# EAGLE design motor_driver_digital (EAGLE 6.2)
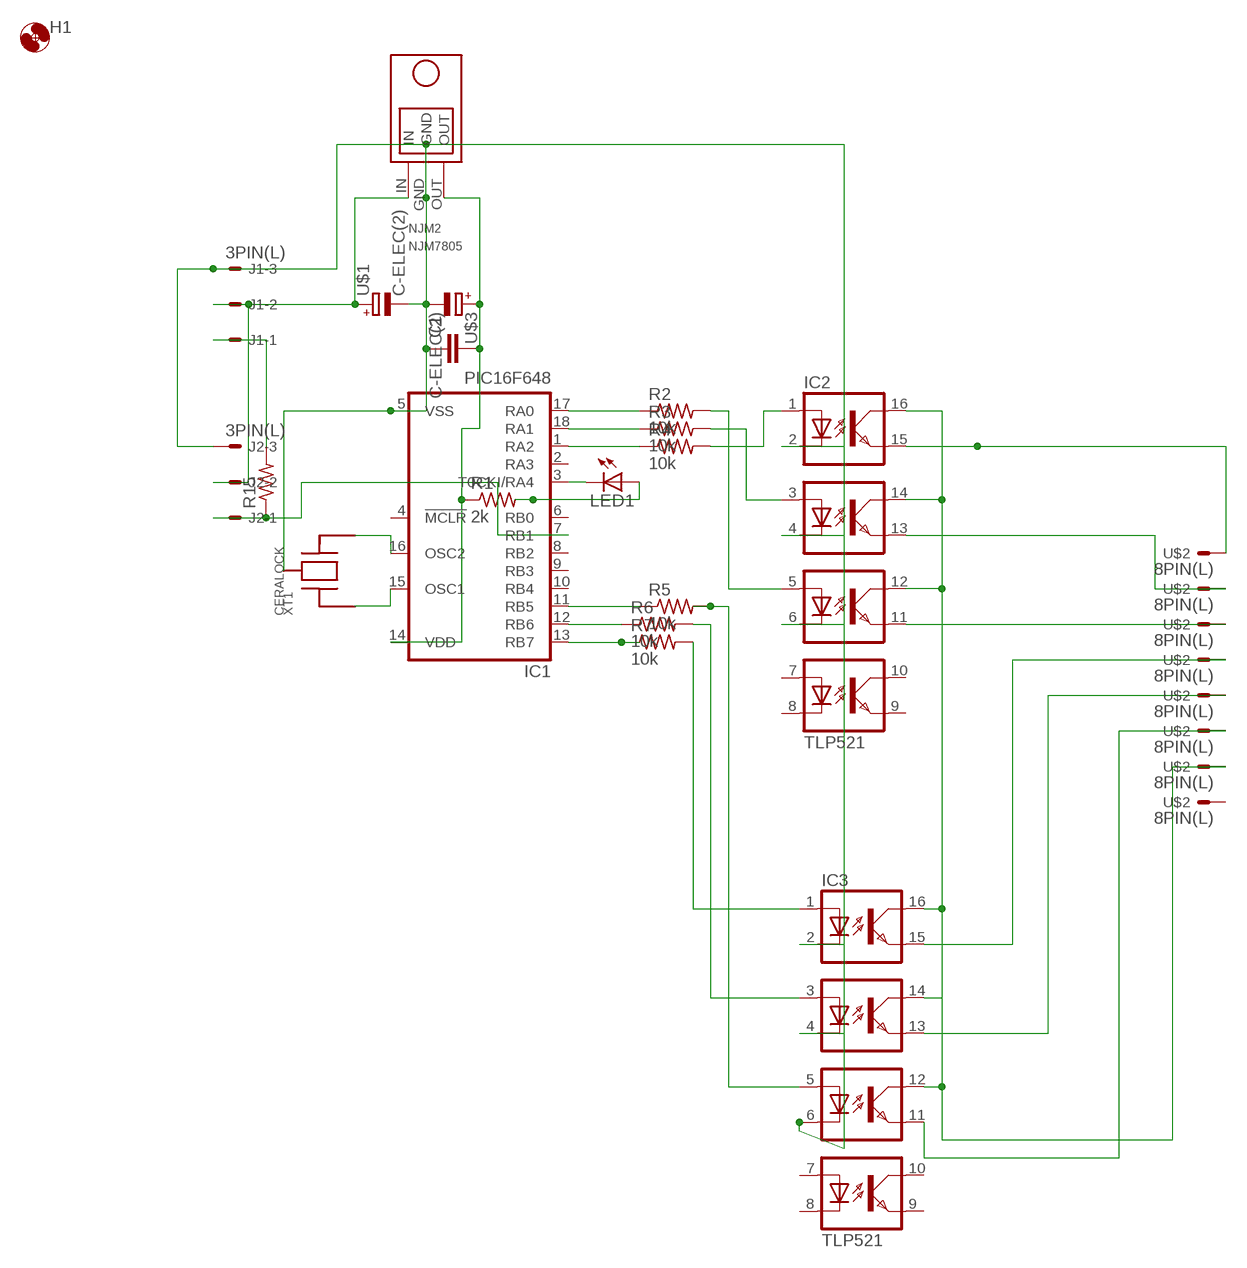
[diagram p0: schematic, sheet 1]

## Parts
C1  C-  [C-2.54]
H1  HOLE3.3M3BOLT  [HOLE3.3]
IC1  PIC16F648  [DIL18]
IC2  TLP521  [DIL16]
IC3  TLP521  [DIL16]
J1  3PIN(L)  [3PL]
J2  3PIN(L)  [3PL]
LED1  LED  [LED5MM]
NJM2  NJM7805  [NJM7805]
R1  2k  R-  [0207/10]
R2  10k  R-  [0207/10]
R3  10k  R-  [0207/10]
R4  10k  R-  [0207/10]
R5  10k  R-  [0207/10]
R6  10k  R-  [0207/10]
R7  10k  R-  [0207/10]
R15  R-  [0207/10]
U$1  C-ELEC(2)  [C-6MM(2)]
U$2  8PIN(L)  [8PL]
U$3  C-ELEC(2)  [C-6MM(2)]
XT1  CERALOCK  [CERALOCK]

## Nets
5V: C1.P$2 IC1.14(VDD) NJM2.OUT R1.1 U$3.+
9V: J1.2 J2.2 NJM2.IN U$1.+
12V: IC2.12(COL2) IC2.14(COL1) IC2.16(COL0) IC3.12(COL2) IC3.14(COL1) IC3.16(COL0) U$2.P7
FET_G2: IC3.11(EMIT2) U$2.P6
GND1: C1.P$1 IC1.5(VSS) IC2.2(C0) IC2.4(C1) IC2.6(C2) IC3.2(C0) IC3.4(C1) IC3.6(C2) J1.3 J2.3 NJM2.GND U$1.- U$3.- XT1.P2
LED_A: LED1.A R1.2
LED_C: IC1.3(T0CKI/RA4) LED1.K(C)
N$1: IC1.16(OSC2) XT1.P3
N$2: J1.1 R15.2
N$3: IC2.11(EMIT2) U$2.P3
N$7: IC1.15(OSC1) XT1.P1
N$10: IC1.17(RA0) R2.1
N$11: IC1.18(RA1) R3.1
N$12: IC1.1(RA2) R4.1
N$13: IC1.13(RB7) R7.1
N$14: IC1.12(RB6) R6.1
N$15: IC1.11(RB5) R5.1
N$16: IC2.5(A2) R2.2
N$17: IC2.3(A1) R3.2
N$18: IC2.1(A0) R4.2
N$19: IC3.1(A0) R7.2
N$20: IC3.3(A1) R6.2
N$21: IC3.5(A2) R5.2
N$23: IC2.15(EMIT0) U$2.P1
N$24: IC2.13(EMIT1) U$2.P2
N$25: IC3.15(EMIT0) U$2.P4
N$26: IC3.13(EMIT1) U$2.P5
SIGNAL: IC1.7(RB1) J2.1 R15.1
Unconnected: IC1.2(RA3) IC1.4(!MCLR) IC1.6(RB0) IC1.8(RB2) IC1.9(RB3) IC1.10(RB4) IC2.7(A3) IC2.8(C3) IC2.9(EMIT3) IC2.10(COL3) IC3.7(A3) IC3.8(C3) IC3.9(EMIT3) IC3.10(COL3) U$2.P8

## Library data of the parts
C1 = My_rcl:C-
H1 = FP-21T for MITS:HOLE3.3
IC1 = FP-21T for MITS:PIC16F648
IC2 IC3 = FP-21T for MITS:TLP521
J1 J2 = my_connector:3PIN(L)
LED1 = my_led:LED: LED
NJM2 = My_NJM7805:NJM7805
R1-R7 R15 = My_rcl:R-: Resistor
U$1 U$3 = My_rcl:C-ELEC(2)
U$2 = my_connector:8PIN(L)
XT1 = ceralock:CERALOCK

## Board
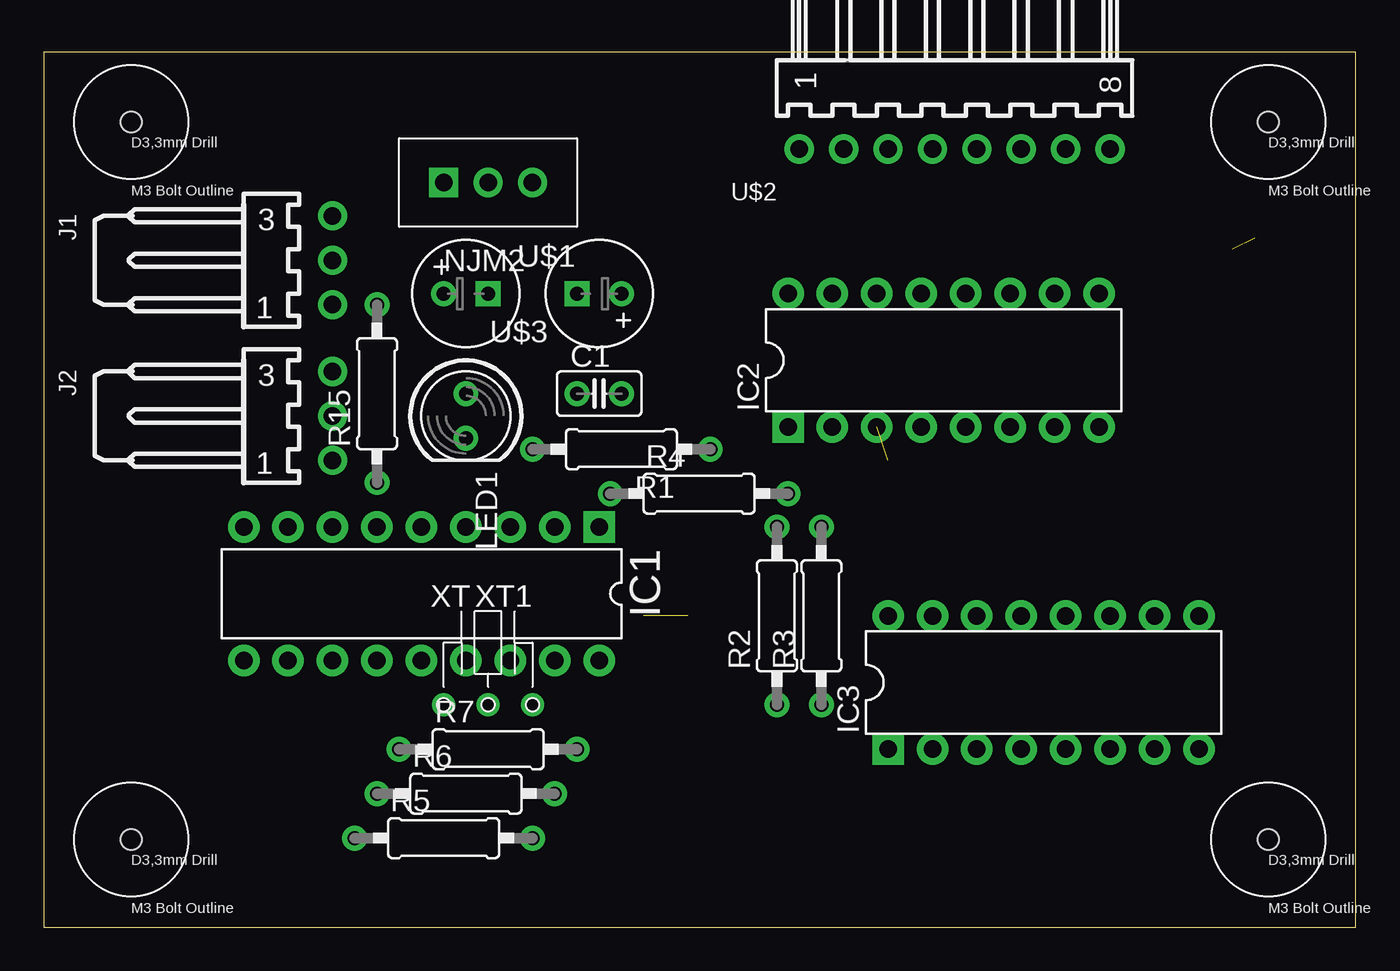
[diagram p1: board, top side]
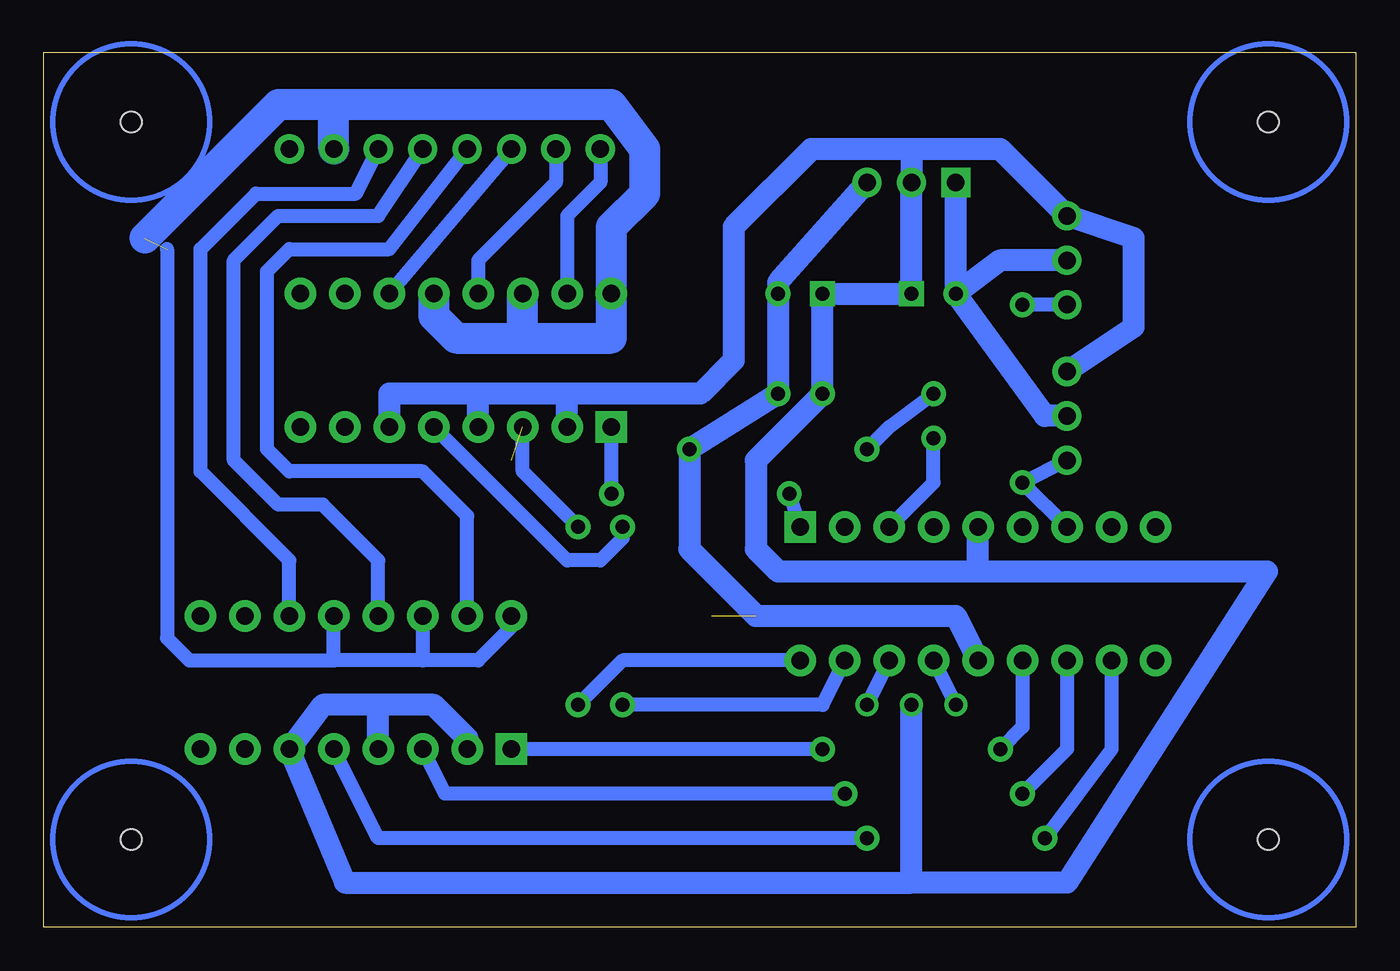
[diagram p2: board, bottom side, seen from below]

Size 75 x 50 mm. Coordinates in mm from the lower left corner, seen from the top.
Outline: 0,0 75,0 75,50 0,50 0,0
Copper layers (1*16): Top 0.035mm / dielectric 1.5mm / Bottom 0.035mm
Design rules: minimum track width 10mil, minimum drill 24mil, track to track 8mil, track to pad 8mil, pad to pad 8mil, via to via 8mil, smd to smd 8mil, copper to edge 40mil, drill to drill 8mil, minimum pad ring 10mil, minimum via ring 8mil, stop-mask expansion 4mil, vias tented up to drill 0mil, thermal gap 10mil

### Footprints (pad centres in the part's own frame; a part is rotated, then mirrored left to right if it is on the bottom)
C-2.54 = drill 0.8 pad 1.422: P$1 -1.27,0; P$2 1.27,0
HOLE3.3 = hole 1.2: 0,0
DIL18 = drill 1 pad 1.8 square: 1 -10.16,-3.81 | drill 1 pad 1.8: 2 -7.62,-3.81; 3 -5.08,-3.81; 4 -2.54,-3.81; 5 0,-3.81; 6 2.54,-3.81; 7 5.08,-3.81; 8 7.62,-3.81; 9 10.16,-3.81; 10 10.16,3.81; 11 7.62,3.81; 12 5.08,3.81; 13 2.54,3.81; 14 0,3.81; 15 -2.54,3.81; 16 -5.08,3.81; 17 -7.62,3.81; 18 -10.16,3.81
DIL16 = drill 1 pad 1.8 square: 1 -8.89,-3.81 | drill 1 pad 1.8: 2 -6.35,-3.81; 3 -3.81,-3.81; 4 -1.27,-3.81; 5 1.27,-3.81; 6 3.81,-3.81; 7 6.35,-3.81; 8 8.89,-3.81; 9 8.89,3.81; 10 6.35,3.81; 11 3.81,3.81; 12 1.27,3.81; 13 -1.27,3.81; 14 -3.81,3.81; 15 -6.35,3.81; 16 -8.89,3.81
3PL = drill 1 pad 1.676: 1 -2.54,-7.62; 2 0,-7.62; 3 2.54,-7.62
LED5MM = drill 0.8 pad 1.422: A -1.27,0; K 1.27,0
NJM7805 = drill 1 pad 1.676: GND 0,0; OUT 2.54,0 | drill 1 pad 1.676 square: IN -2.54,0
0207/10 = drill 0.8 pad 1.422: 1 -5.08,0; 2 5.08,0
C-6MM(2) = drill 0.8 pad 1.422: + -1.27,0 | drill 0.8 pad 1.422 square: - 1.27,0
8PL = drill 1 pad 1.676: P1 -8.89,-3.81; P2 -6.35,-3.81; P3 -3.81,-3.81; P4 -1.27,-3.81; P5 1.27,-3.81; P6 3.81,-3.81; P7 6.35,-3.81; P8 8.89,-3.81
CERALOCK = drill 0.8: P1 -2.54,-3.81; P2 0,-3.81; P3 2.54,-3.81

### Placement (x,y rotation side)
C1  31.75,30.48 0 top
H1  5,5 0 top
H2  HOLE3.3M3BOLT  [HOLE3.3]  70,5 0 top
H3  HOLE3.3M3BOLT  [HOLE3.3]  5,46 0 top
H4  HOLE3.3M3BOLT  [HOLE3.3]  70,46 0 top
IC1  21.59,19.05 180 top
IC2  51.44,32.38 0 top
IC3  57.15,13.97 0 top
J1  8.89,38.1 90 top
J2  8.89,29.21 90 top
LED1  24.13,29.21 270 top
NJM2  25.4,42.55 0 top
R1  33.02,27.3 180 top
R2  41.91,17.78 90 top
R3  44.45,17.78 90 top
R4  37.47,24.77 0 top
R5  22.86,5.08 0 top
R6  24.13,7.62 0 top
R7  25.4,10.16 0 top
R15  19.05,30.48 90 top
U$1  24.13,36.2 0 top
U$2  52.07,48.26 0 top
U$3  31.75,36.2 180 top
XT1  25.4,16.51 0 top

### Tracks (layer width: path | path; a pad name or v marks a point on that pad's centre or on a via)
5V  (1 unrouted)
  Bottom 1.27: IC1.14 22.86,17.78 34.29,17.78 38.1,21.59 R1.1 C1.P$2 U$3.+ 33.02,36.83 NJM2.OUT
9V
  Bottom 1.27: J2.2 17.78,29.21 U$1.+ | J1.2 20.32,38.1 U$1.+ | U$1.+ NJM2.IN
12V  (1 unrouted)
  Bottom 0.813: IC3.16 48.26,17.14 50.16,15.24 53.34,15.24 | IC3.14 53.34,15.24 | 53.34,15.24 58.42,15.24 | 58.42,15.24 IC3.12 | 67.94,38.73 67.94,16.51 66.67,15.24 58.42,15.24
  Bottom 1.778: IC2.12 52.7,34.92 51.44,33.66 47.62,33.66 | 47.62,33.66 IC2.14 | 47.62,33.66 42.55,33.66 IC2.16 42.55,40.01 40.64,41.91 40.64,44.45 42.55,46.99 58.42,46.99 | U$2.P7 58.42,46.99 | 58.42,46.99 61.59,46.99 69.22,39.37
FET_G2
  Bottom 0.813: IC3.11 60.96,20.95 66.04,26.04 66.04,38.73 62.87,41.91 57.15,41.91 U$2.P6
GND1
  Bottom 1.27: 25.4,44.45 NJM2.GND U$1.- U$3.- C1.P$1 34.29,26.67 34.29,21.59 33.02,20.32 21.59,20.32 | J2.3 12.7,34.29 12.7,39.37 J1.3 20.32,44.45 25.4,44.45 | 21.59,20.32 IC1.5 | IC2.2 45.09,30.48 | 45.09,30.48 45.72,30.48 50.16,30.48 | IC2.4 50.16,30.48 | 50.16,30.48 55.24,30.48 IC2.6 | IC3.2 50.8,10.79 52.7,12.7 55.88,12.7 | IC3.4 55.88,12.7 | 25.4,44.45 31.11,44.45 35.56,40.01 35.56,32.38 37.47,30.48 45.09,30.48 | 21.59,20.32 5.08,20.32 16.51,2.54 25.4,2.54 | 25.4,2.54 XT1.P2 | 55.88,12.7 59.05,12.7 IC3.6 57.78,2.54 25.4,2.54
LED_A
  Bottom 0.813: R1.2 26.67,28.57 LED1.A
LED_C
  Bottom 0.813: IC1.3 24.13,25.4 LED1.K
N$1
  Bottom 0.813: XT1.P3 IC1.16
N$2
  Bottom 0.813: J1.1 R15.2
N$3
  Bottom 0.813: U$2.P3 IC2.11
N$7
  Bottom 0.813: XT1.P1 IC1.15
N$10
  Bottom 0.813: IC1.17 30.48,12.7 R2.1
N$11
  Bottom 0.813: IC1.18 41.91,15.24 R3.1
N$12
  Bottom 0.813: IC1.1 R4.1
N$13
  Bottom 0.813: IC1.13 19.05,11.43 R7.1
N$14
  Bottom 0.813: IC1.12 16.51,10.16 R6.1
N$15
  Bottom 0.813: IC1.11 13.97,10.16 R5.1
N$16
  Bottom 0.813: R2.2 41.91,22.23 43.18,20.95 45.09,20.95 IC2.5
N$17  (1 unrouted)
  Bottom 0.813: R3.2 47.62,26.04 IC2.3
N$18
  Bottom 0.813: R4.2 IC2.1
N$19
  Bottom 0.813: R7.2 IC3.1
N$20
  Bottom 0.813: R6.2 52.07,7.62 IC3.3
N$21
  Bottom 0.813: R5.2 55.88,5.08 IC3.5
N$23
  Bottom 0.813: U$2.P1 43.18,42.55 45.09,40.64 IC2.15
N$24
  Bottom 0.813: U$2.P2 45.72,42.55 50.16,38.1 IC2.13
N$25
  Bottom 0.813: IC3.15 50.8,23.5 53.34,26.04 60.96,26.04 62.23,27.3 62.23,37.47 60.96,38.73 55.24,38.73 U$2.P4
N$26
  Bottom 0.813: IC3.13 55.88,20.95 59.05,24.13 61.59,24.13 64.14,26.67 64.14,38.1 61.59,40.64 55.88,40.64 U$2.P5
SIGNAL
  Bottom 0.813: J2.1 R15.1 IC1.7
(copper drawn outside any net)
  shapes: Bottom circle x4